# EAGLE design Trinkey-DualSwitch-Concept1 (EAGLE 9.6.2)
AUTHOR: ladyada
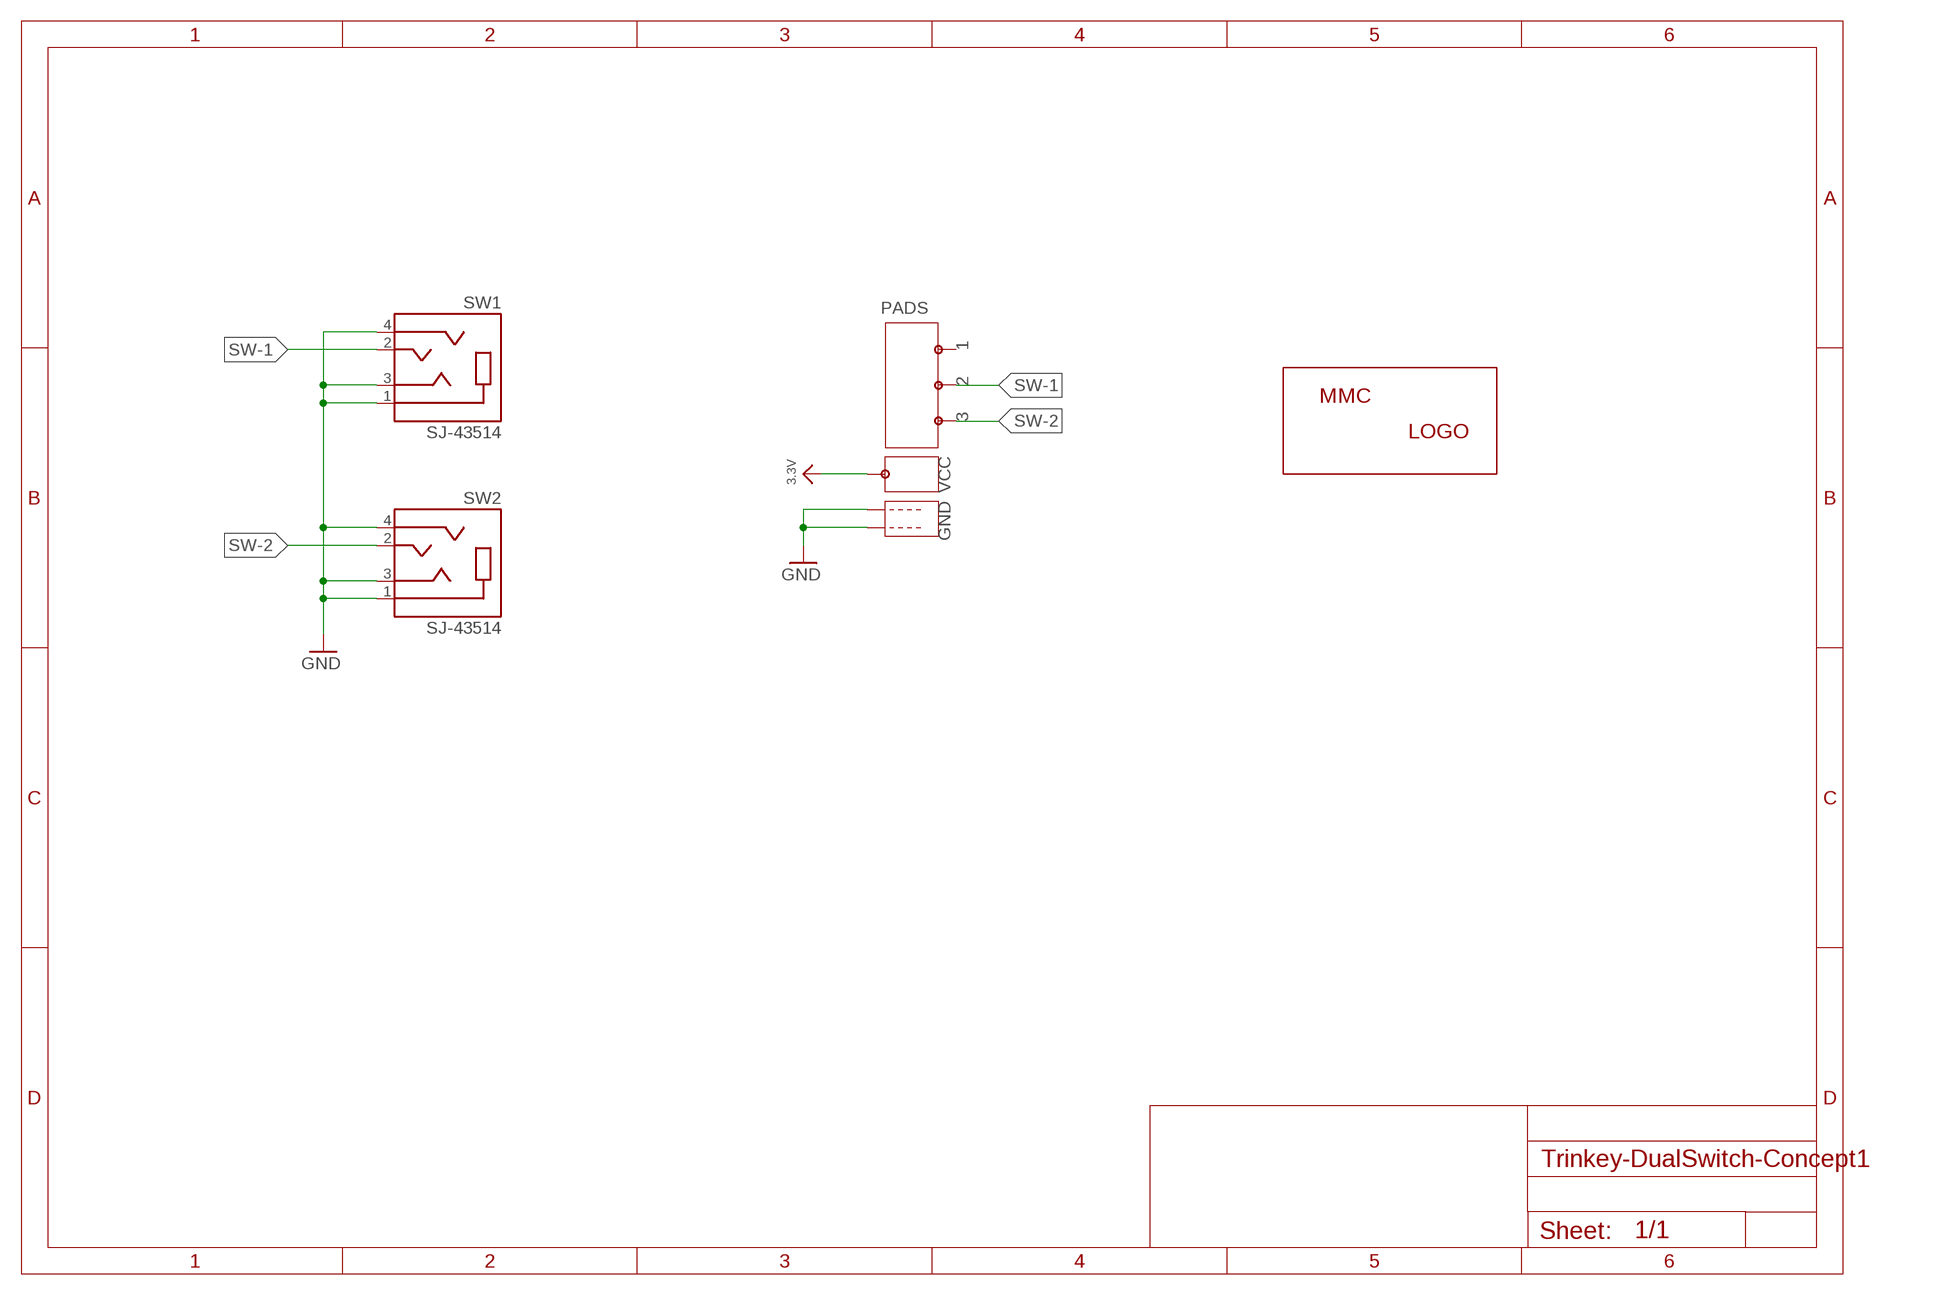
[diagram p0: schematic, sheet 1]

## Parts
LABEL_LOGO  MMC_LOGO-XSM  [MMC_X-SMALL_LOGO]
PADS  CASTELLATED-ROTARY-TRINKEY  [CASTELLATED-ROTARY-TRINKEY]
SW1  SJ-43514  [CUI_SJ-43514]
SW2  SJ-43514  [CUI_SJ-43514]

## Nets
3.3V: PADS.P$VCC
GND: PADS.P$GND1 PADS.P$GND2 SW1.1(SLEEVE) SW1.3(RING1) SW1.4(RING2) SW2.1(SLEEVE) SW2.3(RING1) SW2.4(RING2)
SW-1: PADS.P$S2 SW1.2(TIP)
SW-2: PADS.P$S3 SW2.2(TIP)
Unconnected: PADS.P$S1

## Library data of the parts
LABEL_LOGO = MMC Eagle:MMC_LOGO-
PADS = MMC Eagle:CASTELLATED-ROTARY-TRINKEY: Rotary Encoder with Built-In Switch PEC11 - 24 Step, PEC11-4215F-S24 - http://www.adafruit.com/products/377
SW1 SW2 = MMC Eagle:SJ-43514: SJ-43514 3.50mm (0.141", 1/8", Mini Plug) - Headphone Phone Jack Stereo (4 Conductor, TRRS) Connector. You can use these as jacks to connect analog joysticks or create simple switch interfaces. Options: Digikey - CP-43514-ND <https://www.digikey.ca/en/products/detail/cui-devices/SJ-43514/368146> Mouser - 490-SJ-43514 <https://www.mouser.ca/ProductDetail/CUI-Devices/SJ-43514?qs=WyjlAZoYn51bsBOfuwwiuw%3D%3D>

## Board
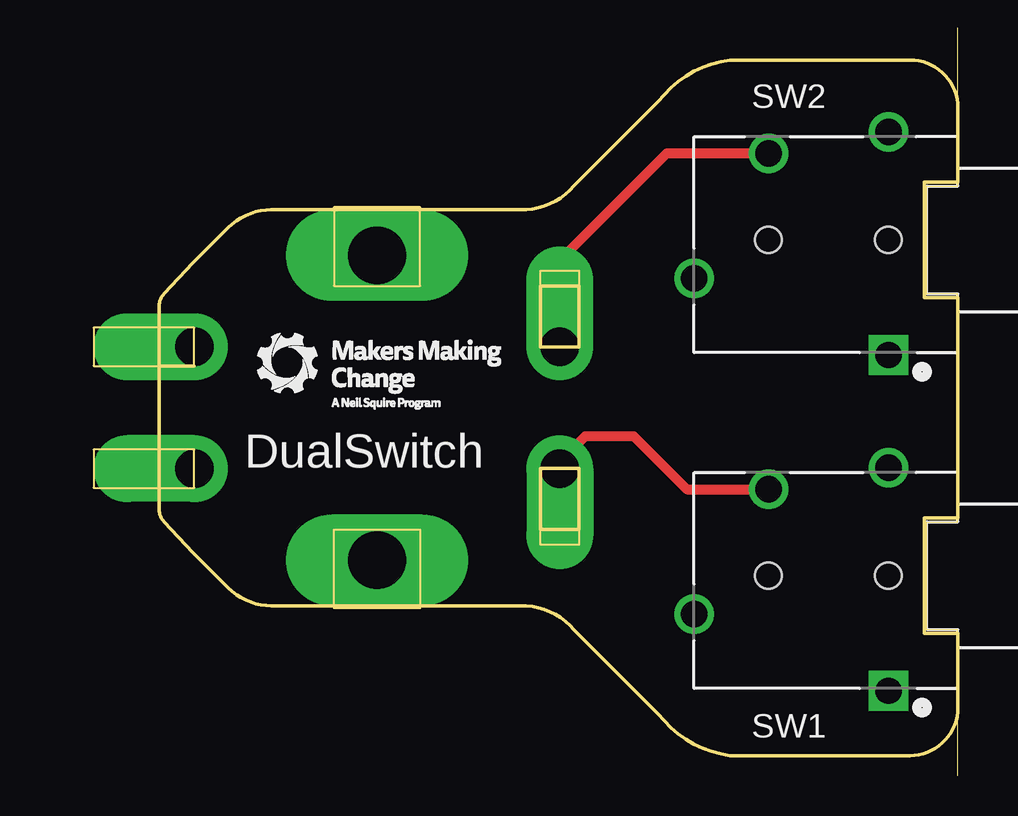
[diagram p1: board, top side]
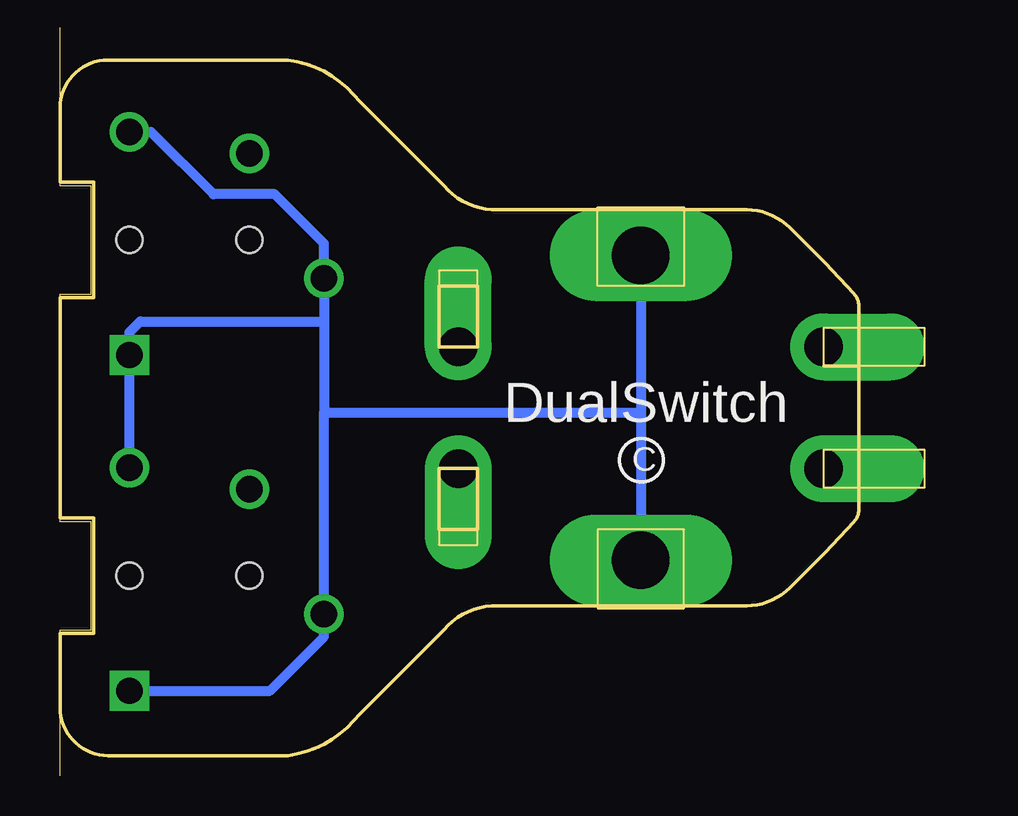
[diagram p2: board, bottom side, seen from below]

Size 33.3 x 29 mm. Coordinates in mm from the lower left corner, seen from the top.
Outline: 0,16.24 1.46,16.24
Outline: 0.2,19.26 1.4,20.53 2.88,22.01 arc-45 4.67,22.75 15.3,22.75 arc45 17.3,23.75 20.8,27.25 arc-45 23.8,29 31.3,29 arc-90 33.3,27 33.3,23.9 31.9,23.9 31.9,19.1 33.3,19.1 33.3,9.9 31.9,9.9 31.9,5.1 33.3,5.1 33.3,2 arc-90 31.3,0 23.8,0 arc-45 20.8,1.75 17.3,5.25 arc45 15.3,6.25 4.67,6.25 arc-45 2.88,6.99 1.4,8.47 0.2,9.74 arc-35 0,10.18 0,18.82 arc-35 0.2,19.26
Outline: 15.9,9.42 15.9,11.96 17.5,11.96 17.5,9.42 15.9,9.42
Outline: 15.9,17.04 15.9,19.58 17.5,19.58 17.5,17.04 15.9,17.04
Copper layers (1*16): Top 0.035mm / dielectric 1.5mm / Bottom 0.035mm
Design rules "adafruit 8-8 *": minimum track width 8mil, minimum drill 15.5mil, track to track 8mil, track to pad 8mil, pad to pad 8mil, via to via 8mil, smd to smd 8mil, copper to edge 10mil, drill to drill 8mil, minimum pad ring 10mil, minimum via ring 8mil, stop-mask expansion 2mil, vias tented up to drill 20mil, thermal gap 10mil

### Footprints (pad centres in the part's own frame; a part is rotated, then mirrored left to right if it is on the bottom)
CASTELLATED-ROTARY-TRINKEY = drill 2.4 pad 3.8 long: P$GND1 -6.35,0; P$GND2 6.35,0 | drill 1.6 pad 2.8 offset: P$S1 2.54,7.62; P$S2 2.54,-7.62; P$S3 -2.54,-7.62; P$VCC -2.54,7.62
CUI_SJ-43514 = drill 1.1 square: 1 -2.6,4.8 | drill 1.1: 2 2.4,-3.6; 3 5.5,1.6; 4 -2.6,-4.5 | hole 1.1: -2.6,0; 2.4,0

### Placement (x,y rotation side)
LABEL_LOGO  9.08,14.45 0 top
PADS  9.08,14.5 270 bottom
SW1  27.8,7.5 180 top
SW2  27.8,21.5 180 top

### Tracks (layer width: path | path; a pad name or v marks a point on that pad's centre or on a via)
GND
  Bottom 0.406: PADS.P$GND1 9.08,14.3 | 9.08,14.3 PADS.P$GND2 | SW2.4 29.5,26 26.9,23.4 24.35,23.4 22.3,21.35 SW2.3 22.3,18.1 | SW1.1 24.55,2.7 22.3,4.95 SW1.3 22.3,14.3 | 22.3,18.1 22.3,14.3 | 22.3,14.3 9.08,14.3 | SW1.4 SW2.1 30.4,17.65 29.95,18.1 22.3,18.1
SW-1
  Top 0.406: PADS.P$S2 16.7,12.26 17.75,13.31 19.79,13.31 22,11.1 SW1.2
SW-2
  Top 0.406: SW2.2 21.15,25.1 16.7,20.65 PADS.P$S3

### Text on the board
tPlace: DualSwitch
bPlace: DualSwitch | C